# EAGLE design I2CRJ45X8 (EAGLE 9.6.2)

## Sheet 1 of 3
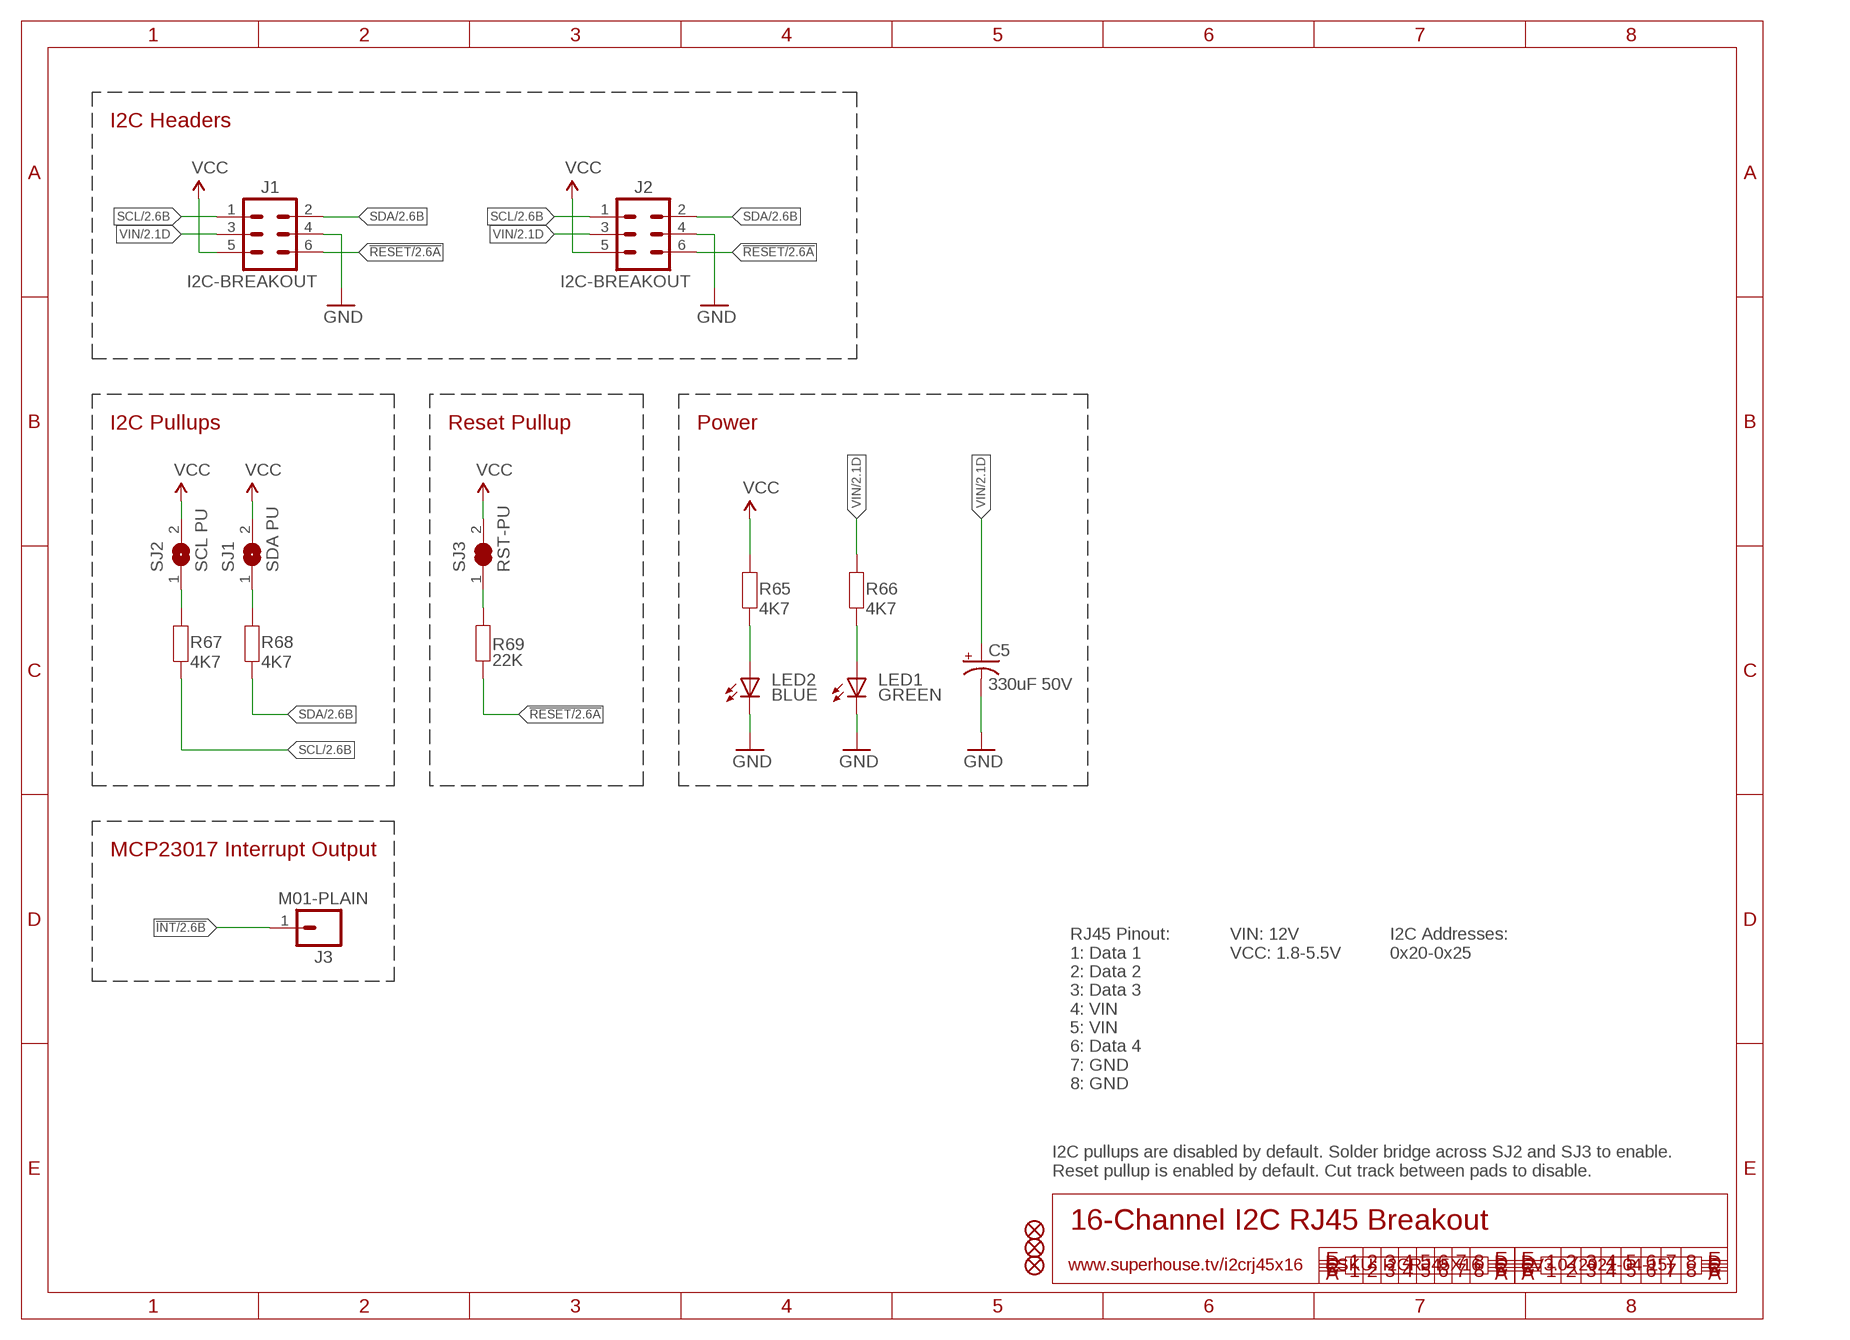
[diagram p0: schematic, sheet 1]

### Parts
C5  330uF 50V  CAP_POLG  [PANASONIC_G]
FID1  FIDUCIAL1X2.5  [FIDUCIAL-1X2.5]
FID2  FIDUCIAL1X2.5  [FIDUCIAL-1X2.5]
FID3  FIDUCIAL1X2.5  [FIDUCIAL-1X2.5]
J1  I2C-BREAKOUT  M02X3-SHROUDED  [2X03-SHROUDED]
J2  I2C-BREAKOUT  M02X3-SHROUDED  [2X03-SHROUDED]
J3  M01-PLAIN  [1X01]
LED1  GREEN  LED0603  [LED-0603]
LED2  BLUE  LED0603  [LED-0603]
R65  4K7  RESISTOR0603  [R0603]
R66  4K7  RESISTOR0603  [R0603]
R67  4K7  RESISTOR0603  [R0603]
R68  4K7  RESISTOR0603  [R0603]
R69  22K  RESISTOR0603  [R0603]
SJ1  SDA PU  SJ-NORMAL  [SJ]
SJ2  SCL PU  SJ-NORMAL  [SJ]
SJ3  RST-PU  SJC-NORMAL  [SJC]

### Nets
!INT: J3.1 ; also sheet 2,3
!RESET: J1.6 J2.6 R69.1 ; also sheet 2,3
GND: C5.- J1.4 J2.4 LED1.C LED2.C ; also sheet 2,3
N$1: R67.2 SJ2.1
N$2: R68.2 SJ1.1
N$3: R69.2 SJ3.1
N$7: LED2.A R65.1
N$8: LED1.A R66.1
SCL: J1.1 J2.1 R67.1 ; also sheet 2,3
SDA: J1.2 J2.2 R68.1 ; also sheet 2,3
VCC: J1.5 J2.5 R65.2 SJ1.2 SJ2.2 SJ3.2 ; also sheet 2,3
VIN: C5.+ J1.3 J2.3 R66.2 ; also sheet 2,3

### Notes on the sheet
- I2C Headers
- I2C Pullups | Reset Pullup | Power
- MCP23017 Interrupt Output
- RJ45 Pinout:
  1: Data 1
  2: Data 2
  3: Data 3
  4: VIN
  5: VIN
  6: Data 4
  7: GND
  8: GND
- VIN: 12V
  VCC: 1.8-5.5V
- I2C Addresses:
  0x20-0x25
- I2C pullups are disabled by default. Solder bridge across SJ2 and SJ3 to enable.
  Reset pullup is enabled by default. Cut track between pads to disable.
- 16-Channel I2C RJ45 Breakout
- www.superhouse.tv/i2crj45x16 | SKU: I2CRJ45X16 | V3.0 (2021-04-15)

## Sheet 2 of 3
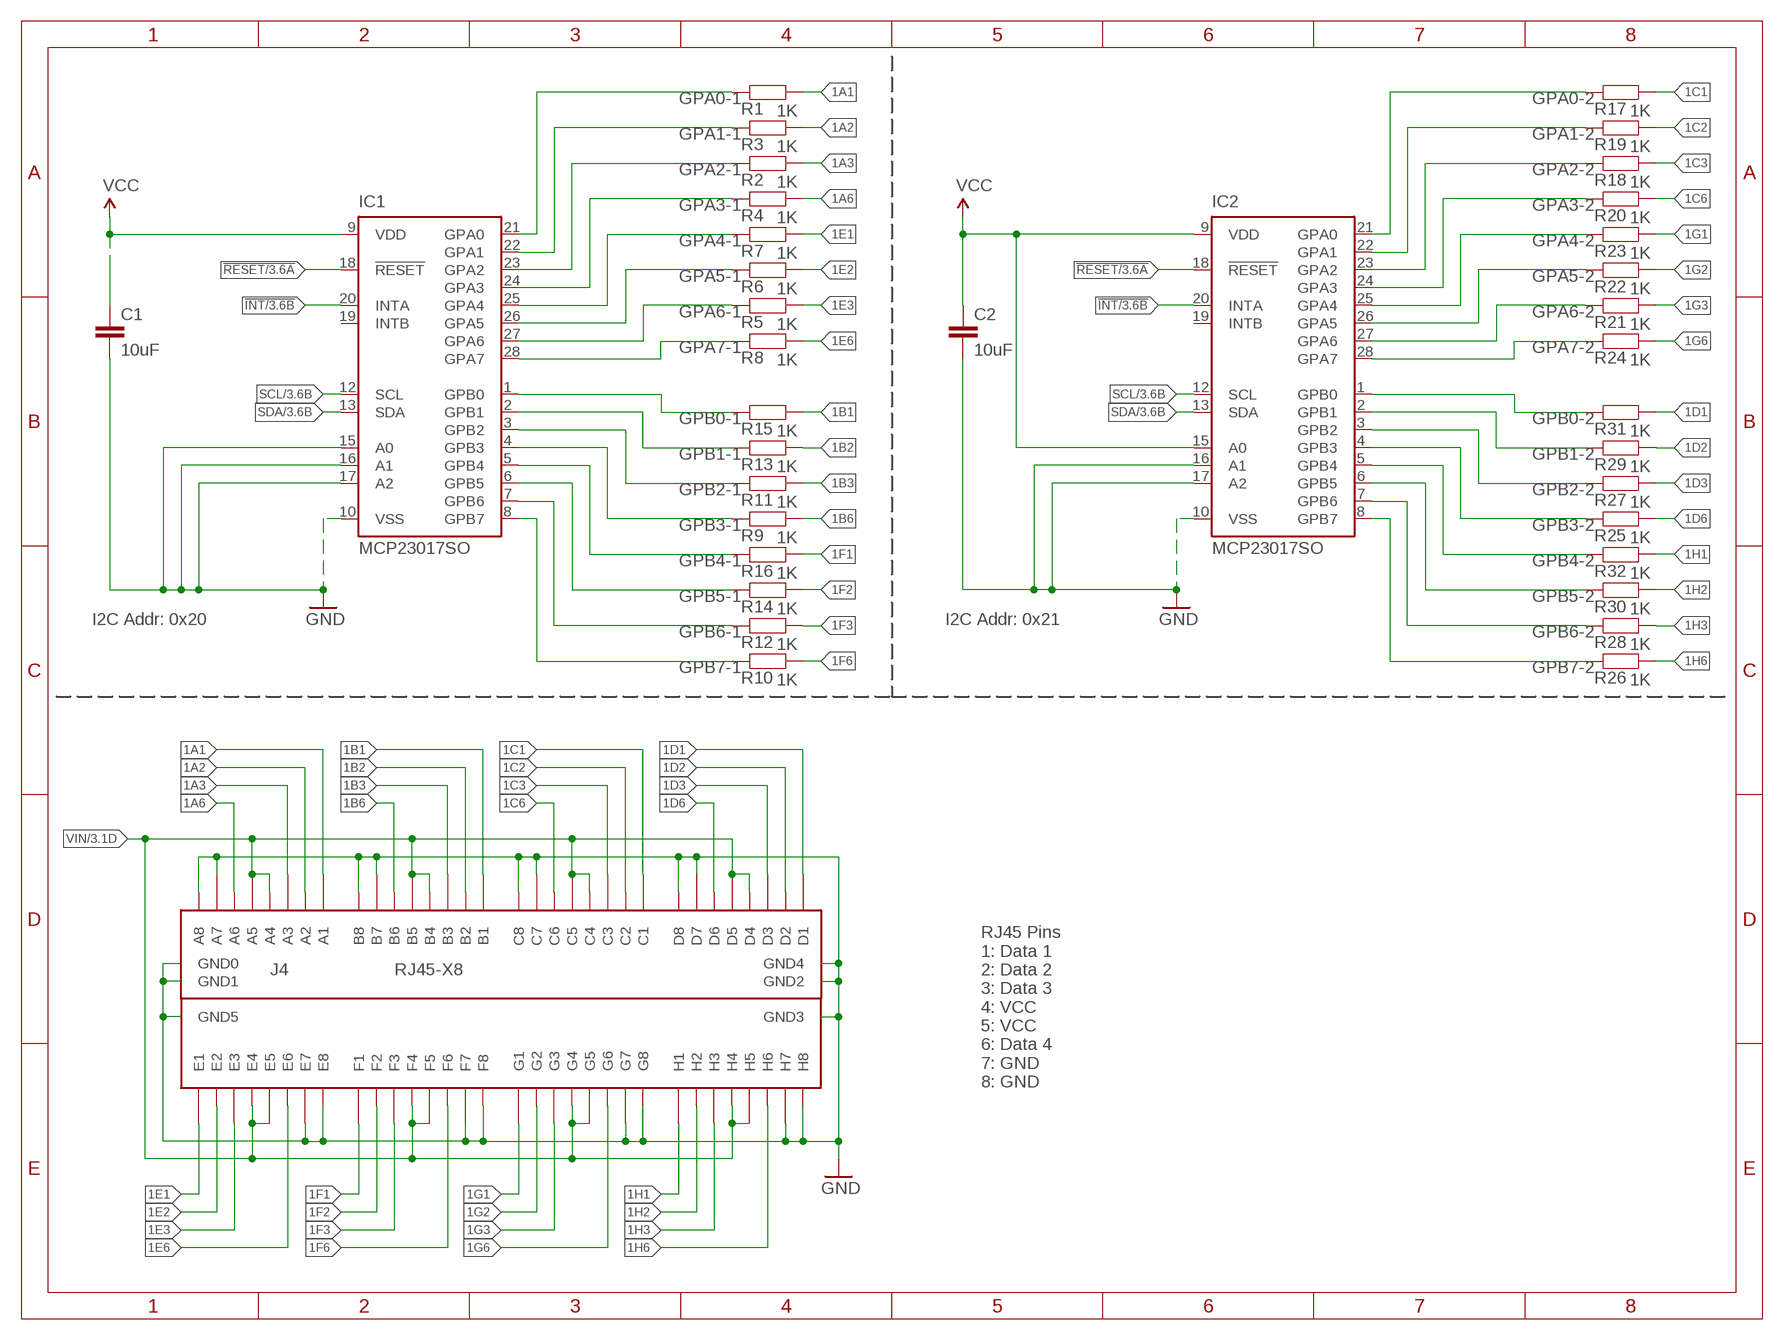
[diagram p1: schematic, sheet 2]

### Parts
C1  10uF  CAP0805  [C0805]
C2  10uF  CAP0805  [C0805]
IC1  MCP23017SO  [SO28W]
IC2  MCP23017SO  [SO28W]
J4  RJ45-X8  [RJ45-2X4]
R1  1K  RESISTOR0603  [R0603]
R2  1K  RESISTOR0603  [R0603]
R3  1K  RESISTOR0603  [R0603]
R4  1K  RESISTOR0603  [R0603]
R5  1K  RESISTOR0603  [R0603]
R6  1K  RESISTOR0603  [R0603]
R7  1K  RESISTOR0603  [R0603]
R8  1K  RESISTOR0603  [R0603]
R9  1K  RESISTOR0603  [R0603]
R10  1K  RESISTOR0603  [R0603]
R11  1K  RESISTOR0603  [R0603]
R12  1K  RESISTOR0603  [R0603]
R13  1K  RESISTOR0603  [R0603]
R14  1K  RESISTOR0603  [R0603]
R15  1K  RESISTOR0603  [R0603]
R16  1K  RESISTOR0603  [R0603]
R17  1K  RESISTOR0603  [R0603]
R18  1K  RESISTOR0603  [R0603]
R19  1K  RESISTOR0603  [R0603]
R20  1K  RESISTOR0603  [R0603]
R21  1K  RESISTOR0603  [R0603]
R22  1K  RESISTOR0603  [R0603]
R23  1K  RESISTOR0603  [R0603]
R24  1K  RESISTOR0603  [R0603]
R25  1K  RESISTOR0603  [R0603]
R26  1K  RESISTOR0603  [R0603]
R27  1K  RESISTOR0603  [R0603]
R28  1K  RESISTOR0603  [R0603]
R29  1K  RESISTOR0603  [R0603]
R30  1K  RESISTOR0603  [R0603]
R31  1K  RESISTOR0603  [R0603]
R32  1K  RESISTOR0603  [R0603]

### Nets
1A1: J4.A1 R1.2
1A2: J4.A2 R3.2
1A3: J4.A3 R2.2
1A6: J4.A6 R4.2
1B1: J4.B1 R15.2
1B2: J4.B2 R13.2
1B3: J4.B3 R11.2
1B6: J4.B6 R9.2
1C1: J4.C1 R17.2
1C2: J4.C2 R19.2
1C3: J4.C3 R18.2
1C6: J4.C6 R20.2
1D1: J4.D1 R31.2
1D2: J4.D2 R29.2
1D3: J4.D3 R27.2
1D6: J4.D6 R25.2
1E1: J4.E1 R7.2
1E2: J4.E2 R6.2
1E3: J4.E3 R5.2
1E6: J4.E6 R8.2
1F1: J4.F1 R16.2
1F2: J4.F2 R14.2
1F3: J4.F3 R12.2
1F6: J4.F6 R10.2
1G1: J4.G1 R23.2
1G2: J4.G2 R22.2
1G3: J4.G3 R21.2
1G6: J4.G6 R24.2
1H1: J4.H1 R32.2
1H2: J4.H2 R30.2
1H3: J4.H3 R28.2
1H6: J4.H6 R26.2
!INT: IC1.20(INTA) IC2.20(INTA) ; also sheet 1,3
!RESET: IC1.18(!RESET) IC2.18(!RESET) ; also sheet 1,3
GND: C1.2 C2.2 IC1.10(VSS) IC1.15(A0) IC1.16(A1) IC1.17(A2) IC2.10(VSS) IC2.16(A1) IC2.17(A2) J4.A7 J4.A8 J4.B7 J4.B8 J4.C7 J4.C8 J4.D7 J4.D8 J4.E7 J4.E8 J4.F7 J4.F8 J4.G7 J4.G8 J4.GND0 J4.GND1 J4.GND2 J4.GND3 J4.GND4 J4.GND5 J4.H7 J4.H8 ; also sheet 1,3
GPA0-1: IC1.21(GPA0) R1.1
GPA0-2: IC2.21(GPA0) R17.1
GPA1-1: IC1.22(GPA1) R3.1
GPA1-2: IC2.22(GPA1) R19.1
GPA2-1: IC1.23(GPA2) R2.1
GPA2-2: IC2.23(GPA2) R18.1
GPA3-1: IC1.24(GPA3) R4.1
GPA3-2: IC2.24(GPA3) R20.1
GPA4-1: IC1.25(GPA4) R7.1
GPA4-2: IC2.25(GPA4) R23.1
GPA5-1: IC1.26(GPA5) R6.1
GPA5-2: IC2.26(GPA5) R22.1
GPA6-1: IC1.27(GPA6) R5.1
GPA6-2: IC2.27(GPA6) R21.1
GPA7-1: IC1.28(GPA7) R8.1
GPA7-2: IC2.28(GPA7) R24.1
GPB0-1: IC1.1(GPB0) R15.1
GPB0-2: IC2.1(GPB0) R31.1
GPB1-1: IC1.2(GPB1) R13.1
GPB1-2: IC2.2(GPB1) R29.1
GPB2-1: IC1.3(GPB2) R11.1
GPB2-2: IC2.3(GPB2) R27.1
GPB3-1: IC1.4(GPB3) R9.1
GPB3-2: IC2.4(GPB3) R25.1
GPB4-1: IC1.5(GPB4) R16.1
GPB4-2: IC2.5(GPB4) R32.1
GPB5-1: IC1.6(GPB5) R14.1
GPB5-2: IC2.6(GPB5) R30.1
GPB6-1: IC1.7(GPB6) R12.1
GPB6-2: IC2.7(GPB6) R28.1
GPB7-1: IC1.8(GPB7) R10.1
GPB7-2: IC2.8(GPB7) R26.1
SCL: IC1.12(SCL) IC2.12(SCL) ; also sheet 1,3
SDA: IC1.13(SDA) IC2.13(SDA) ; also sheet 1,3
VCC: C1.1 C2.1 IC1.9(VDD) IC2.9(VDD) IC2.15(A0) ; also sheet 1,3
VIN: J4.A4 J4.A5 J4.B4 J4.B5 J4.C4 J4.C5 J4.D4 J4.D5 J4.E4 J4.E5 J4.F4 J4.F5 J4.G4 J4.G5 J4.H4 J4.H5 ; also sheet 1,3
Unconnected: IC1.19(INTB) IC2.19(INTB)

### Notes on the sheet
- I2C Addr: 0x20 | I2C Addr: 0x21
- RJ45 Pins
  1: Data 1
  2: Data 2
  3: Data 3
  4: VCC
  5: VCC
  6: Data 4
  7: GND
  8: GND

## Sheet 3 of 3
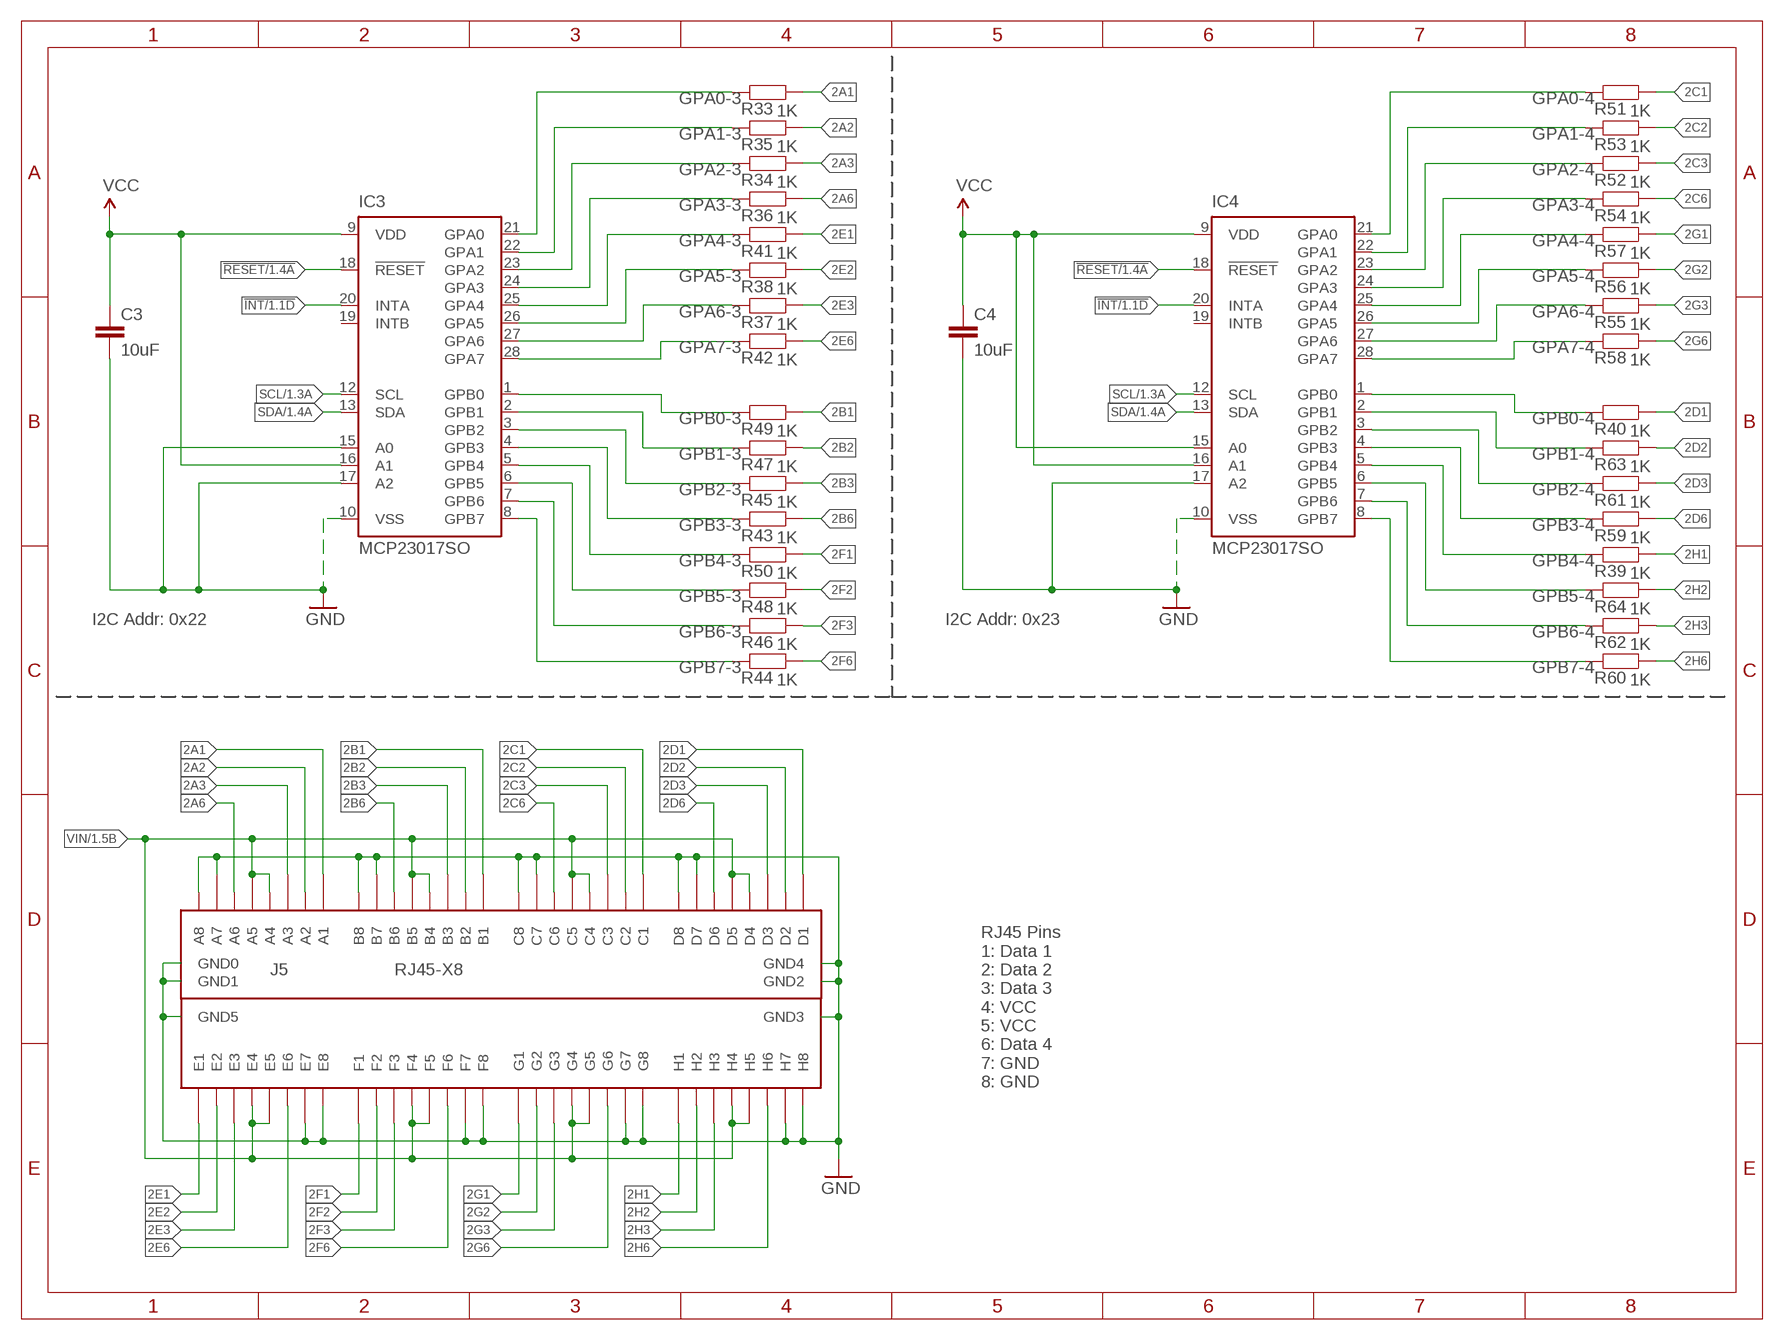
[diagram p2: schematic, sheet 3]

### Parts
C3  10uF  CAP0805  [C0805]
C4  10uF  CAP0805  [C0805]
IC3  MCP23017SO  [SO28W]
IC4  MCP23017SO  [SO28W]
J5  RJ45-X8  [RJ45-2X4]
R33  1K  RESISTOR0603  [R0603]
R34  1K  RESISTOR0603  [R0603]
R35  1K  RESISTOR0603  [R0603]
R36  1K  RESISTOR0603  [R0603]
R37  1K  RESISTOR0603  [R0603]
R38  1K  RESISTOR0603  [R0603]
R39  1K  RESISTOR0603  [R0603]
R40  1K  RESISTOR0603  [R0603]
R41  1K  RESISTOR0603  [R0603]
R42  1K  RESISTOR0603  [R0603]
R43  1K  RESISTOR0603  [R0603]
R44  1K  RESISTOR0603  [R0603]
R45  1K  RESISTOR0603  [R0603]
R46  1K  RESISTOR0603  [R0603]
R47  1K  RESISTOR0603  [R0603]
R48  1K  RESISTOR0603  [R0603]
R49  1K  RESISTOR0603  [R0603]
R50  1K  RESISTOR0603  [R0603]
R51  1K  RESISTOR0603  [R0603]
R52  1K  RESISTOR0603  [R0603]
R53  1K  RESISTOR0603  [R0603]
R54  1K  RESISTOR0603  [R0603]
R55  1K  RESISTOR0603  [R0603]
R56  1K  RESISTOR0603  [R0603]
R57  1K  RESISTOR0603  [R0603]
R58  1K  RESISTOR0603  [R0603]
R59  1K  RESISTOR0603  [R0603]
R60  1K  RESISTOR0603  [R0603]
R61  1K  RESISTOR0603  [R0603]
R62  1K  RESISTOR0603  [R0603]
R63  1K  RESISTOR0603  [R0603]
R64  1K  RESISTOR0603  [R0603]

### Nets
2A1: J5.A1 R33.2
2A2: J5.A2 R35.2
2A3: J5.A3 R34.2
2A6: J5.A6 R36.2
2B1: J5.B1 R49.2
2B2: J5.B2 R47.2
2B3: J5.B3 R45.2
2B6: J5.B6 R43.2
2C1: J5.C1 R51.2
2C2: J5.C2 R53.2
2C3: J5.C3 R52.2
2C6: J5.C6 R54.2
2D1: J5.D1 R40.2
2D2: J5.D2 R63.2
2D3: J5.D3 R61.2
2D6: J5.D6 R59.2
2E1: J5.E1 R41.2
2E2: J5.E2 R38.2
2E3: J5.E3 R37.2
2E6: J5.E6 R42.2
2F1: J5.F1 R50.2
2F2: J5.F2 R48.2
2F3: J5.F3 R46.2
2F6: J5.F6 R44.2
2G1: J5.G1 R57.2
2G2: J5.G2 R56.2
2G3: J5.G3 R55.2
2G6: J5.G6 R58.2
2H1: J5.H1 R39.2
2H2: J5.H2 R64.2
2H3: J5.H3 R62.2
2H6: J5.H6 R60.2
!INT: IC3.20(INTA) IC4.20(INTA) ; also sheet 1,2
!RESET: IC3.18(!RESET) IC4.18(!RESET) ; also sheet 1,2
GND: C3.2 C4.2 IC3.10(VSS) IC3.15(A0) IC3.17(A2) IC4.10(VSS) IC4.17(A2) J5.A7 J5.A8 J5.B7 J5.B8 J5.C7 J5.C8 J5.D7 J5.D8 J5.E7 J5.E8 J5.F7 J5.F8 J5.G7 J5.G8 J5.GND0 J5.GND1 J5.GND2 J5.GND3 J5.GND4 J5.GND5 J5.H7 J5.H8 ; also sheet 1,2
GPA0-3: IC3.21(GPA0) R33.1
GPA0-4: IC4.21(GPA0) R51.1
GPA1-3: IC3.22(GPA1) R35.1
GPA1-4: IC4.22(GPA1) R53.1
GPA2-3: IC3.23(GPA2) R34.1
GPA2-4: IC4.23(GPA2) R52.1
GPA3-3: IC3.24(GPA3) R36.1
GPA3-4: IC4.24(GPA3) R54.1
GPA4-3: IC3.25(GPA4) R41.1
GPA4-4: IC4.25(GPA4) R57.1
GPA5-3: IC3.26(GPA5) R38.1
GPA5-4: IC4.26(GPA5) R56.1
GPA6-3: IC3.27(GPA6) R37.1
GPA6-4: IC4.27(GPA6) R55.1
GPA7-3: IC3.28(GPA7) R42.1
GPA7-4: IC4.28(GPA7) R58.1
GPB0-3: IC3.1(GPB0) R49.1
GPB0-4: IC4.1(GPB0) R40.1
GPB1-3: IC3.2(GPB1) R47.1
GPB1-4: IC4.2(GPB1) R63.1
GPB2-3: IC3.3(GPB2) R45.1
GPB2-4: IC4.3(GPB2) R61.1
GPB3-3: IC3.4(GPB3) R43.1
GPB3-4: IC4.4(GPB3) R59.1
GPB4-3: IC3.5(GPB4) R50.1
GPB4-4: IC4.5(GPB4) R39.1
GPB5-3: IC3.6(GPB5) R48.1
GPB5-4: IC4.6(GPB5) R64.1
GPB6-3: IC3.7(GPB6) R46.1
GPB6-4: IC4.7(GPB6) R62.1
GPB7-3: IC3.8(GPB7) R44.1
GPB7-4: IC4.8(GPB7) R60.1
SCL: IC3.12(SCL) IC4.12(SCL) ; also sheet 1,2
SDA: IC3.13(SDA) IC4.13(SDA) ; also sheet 1,2
VCC: C3.1 C4.1 IC3.9(VDD) IC3.16(A1) IC4.9(VDD) IC4.15(A0) IC4.16(A1) ; also sheet 1,2
VIN: J5.A4 J5.A5 J5.B4 J5.B5 J5.C4 J5.C5 J5.D4 J5.D5 J5.E4 J5.E5 J5.F4 J5.F5 J5.G4 J5.G5 J5.H4 J5.H5 ; also sheet 1,2
Unconnected: IC3.19(INTB) IC4.19(INTB)

### Notes on the sheet
- I2C Addr: 0x22 | I2C Addr: 0x23
- RJ45 Pins
  1: Data 1
  2: Data 2
  3: Data 3
  4: VCC
  5: VCC
  6: Data 4
  7: GND
  8: GND

## Library data of the parts
C1-C4 = SuperHouse-DiscreteSemi:CAP: Capacitor Standard ceramic capacitor
C5 = SuperHouse-DiscreteSemi:CAP_POL: Capacitor Polarized These are standard SMD and PTH capacitors. Normally 10uF, 47uF, and 100uF in electrolytic and tantalum varieties. Always verify the external diameter of the through hole cap, it varies with capacity, voltage, and manufacturer. The EIA devices should be standard.
FID1-FID3 = SuperHouse-Symbols:FIDUCIAL: Fiducial Alignment Points Various fiducial points for machine vision alignment.
IC1-IC4 = SuperHouse-ICs:MCP23017: http://ww1.microchip.com/downloads/en/DeviceDoc/21952a.pdf Source: http://ww1.microchip.com/downloads/en/DeviceDoc/21952a.pdf
J1 J2 = SuperHouse-Connectors:M02X3: 0.1" header, 2x3 (6-way)
J3 = SuperHouse-Connectors:M01: 1-way header Standard 1x1 header
J4 J5 = SuperHouse-Connectors:RJ45-X8: 8-way RJ45 socket, PCB mount. 2 rows of 4.
LED1 LED2 = SuperHouse-LEDs:LED: LEDs Standard schematic elements and footprints for 5mm, 3mm, 1206, and 0603 sized LEDs. 5mm - Spark Fun Electronics SKU : COM-00529 (and others)
R1-R69 = SuperHouse-DiscreteSemi:RESISTOR: Resistors in both surface-mount and through-hole versions.
SJ1 SJ2 = SuperHouse-Jumpers:SJ: SMD solder jumper, normally-open. Add solder to close the connection.
SJ3 = SuperHouse-Jumpers:SJC: Solder jumper. Normally closed: does not need solder to close. Can be opened by cutting the track.

## Board
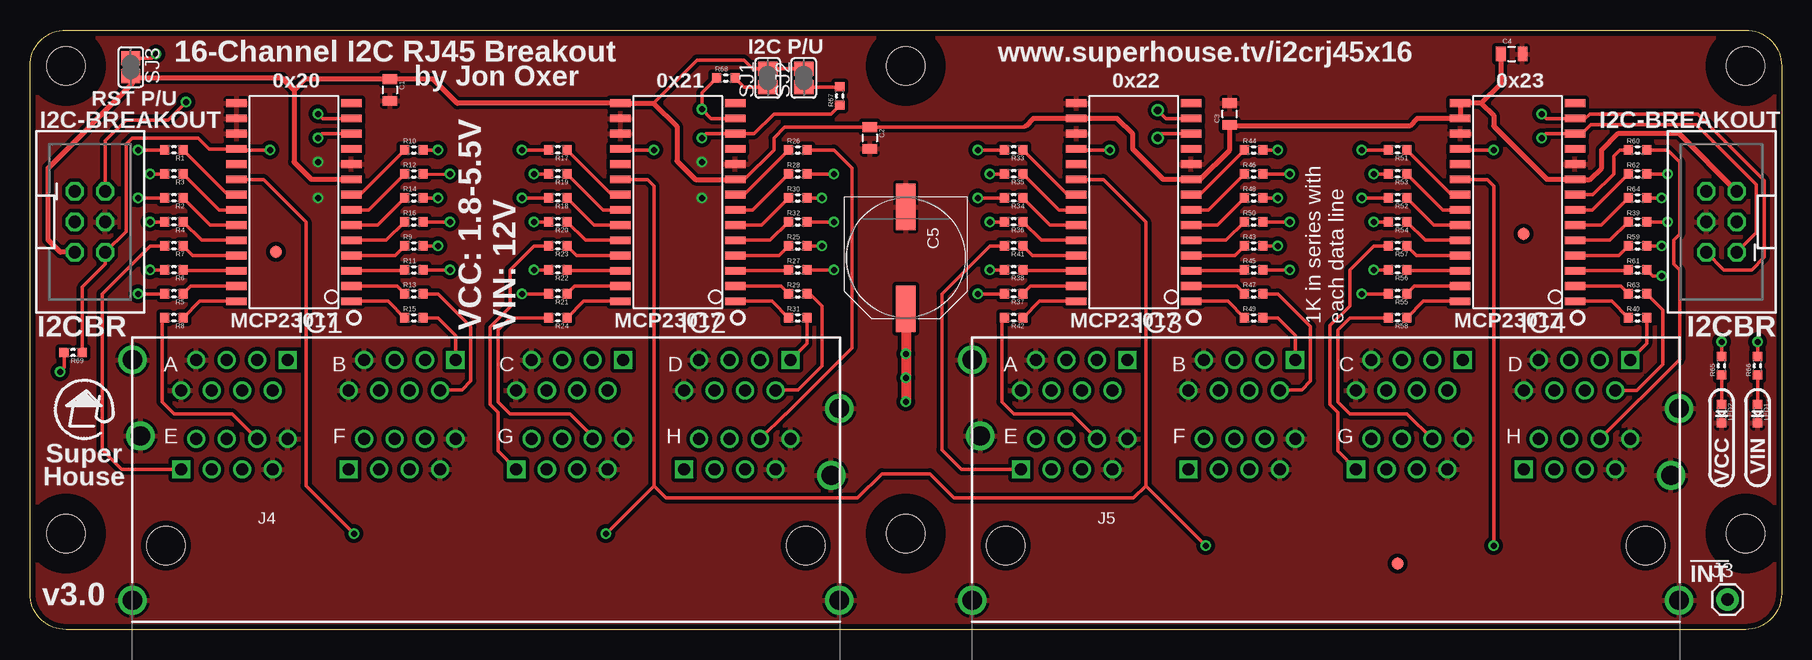
[diagram p3: board, top side]
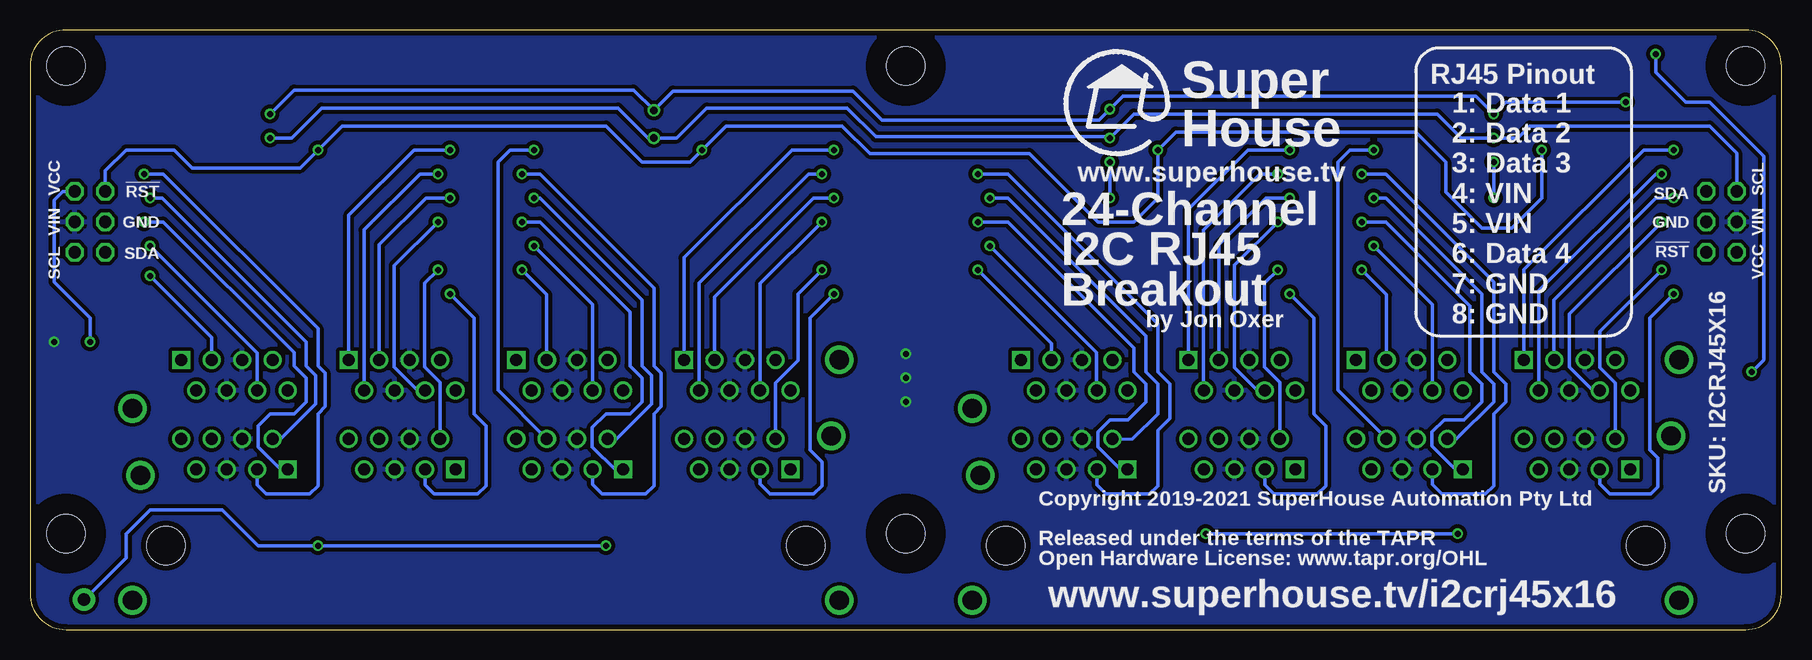
[diagram p4: board, bottom side, seen from below]

Size 146 x 50 mm. Coordinates in mm from the lower left corner, seen from the top.
Outline: 3,0 arc-90 0,3 0,47 arc-90 3,50 143,50 arc-90 146,47 146,3 arc-90 143,0 3,0
Copper layers (1*16): Top 0.035mm / dielectric 1.5mm / Bottom 0.035mm
Design rules "default *": minimum track width 10mil, minimum drill 0.5mm, track to track 12mil, track to pad 12mil, pad to pad 12mil, via to via 12mil, smd to smd 8mil, copper to edge 18mil, drill to drill 8mil, minimum pad ring 10mil, minimum via ring 8mil, stop-mask expansion 4mil, vias tented up to drill 25mil, thermal gap 10mil
Holes 3.2 mm at 143,8 143,47 73,8 73,47 3,8 3,47
tRestrict: area 69.8,4.8 to 76.2,11.2; area 139.8,4.8 to 146.2,11.2; area 139.8,43.8 to 146.2,50.2; area 69.8,43.8 to 76.2,50.2; area -0.2,4.8 to 6.2,11.2; area -0.2,43.8 to 6.2,50.2
bRestrict: area 69.8,43.8 to 76.2,50.2; area 139.8,43.8 to 146.2,50.2; area 69.8,4.8 to 76.2,11.2; area 139.8,4.8 to 146.2,11.2; area -0.2,4.8 to 6.2,11.2; area -0.2,43.8 to 6.2,50.2

### Footprints (pad centres in the part's own frame; a part is rotated, then mirrored left to right if it is on the bottom)
C0805 = smd 0.8 x 1.2: 1 -0.9,0; 2 0.9,0
PANASONIC_G = smd 3.9 x 1.6: + 4.25,0; - -4.25,0
FIDUCIAL-1X2.5 = smd 1 x 1: 1 0,0
SO28W = smd 0.65 x 1.7: 1 -7.62,-4.78; 2 -6.35,-4.78; 3 -5.08,-4.78; 4 -3.81,-4.78; 5 -2.54,-4.78; 6 -1.27,-4.78; 7 0,-4.78; 8 1.27,-4.78; 9 2.54,-4.78; 10 3.81,-4.78; 11 5.08,-4.78; 12 6.35,-4.78; 13 7.62,-4.78; 14 8.89,-4.78; 15 8.89,4.78; 16 7.62,4.78; 17 6.35,4.78; 18 5.08,4.78; 19 3.81,4.78; 20 2.54,4.78; 21 1.27,4.78; 22 0,4.78; 23 -1.27,4.78; 24 -2.54,4.78; 25 -3.81,4.78; 26 -5.08,4.78; 27 -6.35,4.78; 28 -7.62,4.78
2X03-SHROUDED = drill 1.016 octagon: 1 -1.27,2.54; 2 1.27,2.54; 3 -1.27,0; 4 1.27,0; 5 -1.27,-2.54; 6 1.27,-2.54
1X01 = drill 1.016 pad 1.88: 1 0,0
RJ45-2X4 = drill 1 square: A1 -16.51,15.49; B1 -2.54,15.49; C1 11.43,15.49; D1 25.4,15.49; E1 -25.4,6.35; F1 -11.43,6.35; G1 2.54,6.35; H1 16.51,6.35 | drill 1: A2 -17.78,12.95; A3 -19.05,15.49; A4 -20.32,12.95; A5 -21.59,15.49; A6 -22.86,12.95; A7 -24.13,15.49; A8 -25.4,12.95; B2 -3.81,12.95; B3 -5.08,15.49; B4 -6.35,12.95; B5 -7.62,15.49; B6 -8.89,12.95; B7 -10.16,15.49; B8 -11.43,12.95; C2 10.16,12.95; C3 8.89,15.49; C4 7.62,12.95; C5 6.35,15.49; C6 5.08,12.95; C7 3.81,15.49; C8 2.54,12.95; D2 24.13,12.95; D3 22.86,15.49; D4 21.59,12.95; D5 20.32,15.49; D6 19.05,12.95; D7 17.78,15.49; D8 16.51,12.95; E2 -24.13,8.89; E3 -22.86,6.35; E4 -21.59,8.89; E5 -20.32,6.35; E6 -19.05,8.89; E7 -17.78,6.35; E8 -16.51,8.89; F2 -10.16,8.89; F3 -8.89,6.35; F4 -7.62,8.89; F5 -6.35,6.35; F6 -5.08,8.89; F7 -3.81,6.35; F8 -2.54,8.89; G2 3.81,8.89; G3 5.08,6.35; G4 6.35,8.89; G5 7.62,6.35; G6 8.89,8.89; G7 10.16,6.35; G8 11.43,8.89; H2 17.78,8.89; H3 19.05,6.35; H4 20.32,8.89; H5 21.59,6.35; H6 22.86,8.89; H7 24.13,6.35; H8 25.4,8.89 | drill 1.6: GND0 29.464,-4.572; GND1 28.79,5.85; GND2 -29.46,15.5; GND3 -28.79,9.15; GND4 -29.464,-4.572; GND5 29.46,11.43 | hole 3.2: 26.67,0; -26.67,0
LED-0603 = smd 0.762 x 0.762: A -0.762,0; C 0.762,0
R0603 = smd 0.762 x 0.762: 1 -0.762,0; 2 0.762,0
SJ = smd 1.168 x 1.6: 1 -0.762,0; 2 0.762,0
SJC = smd 1.168 x 1.6: 1 -0.762,0; 2 0.762,0

### Placement (x,y rotation side)
C1  30,45 270 top
C2  70,41 270 top
C3  100,43 90 top
C4  123.5,48 0 top
C5  73,31 270 top
FID1  20.5,31.5 0 top
FID2  124.5,33 0 top
FID3  114,5.5 0 top
IC1  22,35 90 top
IC2  54,35 90 top
IC3  92,35 90 top
IC4  124,35 90 top
J1  5,34 0 top
J2  141,34 180 top
J3  141.5,2.5 0 top
J4  38,7 0 top
J5  108,7 0 top
LED1  144,18 270 top
LED2  141,18 270 top
R1  12,40 180 top
R2  12,36 180 top
R3  12,38 180 top
R4  12,34 180 top
R5  12,28 180 top
R6  12,30 180 top
R7  12,32 180 top
R8  12,26 180 top
R9  32,32 0 top
R10  32,40 0 top
R11  32,30 0 top
R12  32,38 0 top
R13  32,28 0 top
R14  32,36 0 top
R15  32,26 0 top
R16  32,34 0 top
R17  44,40 180 top
R18  44,36 180 top
R19  44,38 180 top
R20  44,34 180 top
R21  44,28 180 top
R22  44,30 180 top
R23  44,32 180 top
R24  44,26 180 top
R25  64,32 0 top
R26  64,40 0 top
R27  64,30 0 top
R28  64,38 0 top
R29  64,28 0 top
R30  64,36 0 top
R31  64,26 0 top
R32  64,34 0 top
R33  82,40 180 top
R34  82,36 180 top
R35  82,38 180 top
R36  82,34 180 top
R37  82,28 180 top
R38  82,30 180 top
R39  134,34 0 top
R40  134,26 0 top
R41  82,32 180 top
R42  82,26 180 top
R43  102,32 0 top
R44  102,40 0 top
R45  102,30 0 top
R46  102,38 0 top
R47  102,28 0 top
R48  102,36 0 top
R49  102,26 0 top
R50  102,34 0 top
R51  114,40 180 top
R52  114,36 180 top
R53  114,38 180 top
R54  114,34 180 top
R55  114,28 180 top
R56  114,30 180 top
R57  114,32 180 top
R58  114,26 180 top
R59  134,32 0 top
R60  134,40 0 top
R61  134,30 0 top
R62  134,38 0 top
R63  134,28 0 top
R64  134,36 0 top
R65  141,22 90 top
R66  144,22 90 top
R67  67.5,44.5 90 top
R68  58,46 0 top
R69  3.6,23.1 180 top
SJ1  61.5,46 90 top
SJ2  64.5,46 90 top
SJ3  8.4,46.9 270 top

### Tracks (layer width: path | path; a pad name or v marks a point on that pad's centre or on a via)
1A1  (via drill 0.5)
  Top 0.305: v9,40 R1.2
  Bottom 0.305: J4.A1 21.49,30.01 11.5,40 v9,40
1A2  (via drill 0.5)
  Top 0.305: v10,38 R3.2
  Bottom 0.305: J4.A2 20.22,28.28 10.5,38 v10,38
1A3  (via drill 0.5)
  Top 0.305: v9,36 R2.2
  Bottom 0.254: J4.A3 19,22.54
  Bottom 0.305: 19,22.54 19,27.5 10.5,36 v9,36
1A6  (via drill 0.5)
  Top 0.305: v10,34 R4.2
  Bottom 0.305: v10,34 17.7,26.3 17.7,21.9 15.75,19.95 J4.A6
1B1
  Top 0.305: R15.2 34,26 35.46,24.54 J4.B1
1B2
  Top 0.254: J4.B2 34.24,20
  Top 0.305: 34.24,20 36,20 36.75,20.75 36.75,25.25 34,28 R13.2
1B3  (via drill 0.5)
  Top 0.305: R11.2 v35,30
  Bottom 0.305: J4.B3 32.92,27.92 v35,30
1B6  (via drill 0.5)
  Top 0.305: R9.2 v34,32
  Bottom 0.305: J4.B6 29.11,27.11 v34,32
1C1  (via drill 0.5)
  Top 0.305: v41,40 R17.2
  Bottom 0.305: J4.C1 49.43,35.07 44.5,40 v41,40
1C2  (via drill 0.5)
  Top 0.305: v42,38 R19.2
  Bottom 0.254: J4.C2 48.18,19.97
  Bottom 0.305: 48.18,19.97 48.18,33.32 43.5,38 v42,38
1C3  (via drill 0.5)
  Top 0.305: v41,36 R18.2
  Bottom 0.254: J4.C3
  Bottom 0.305: J4.C3 46.9,32.1 43,36 v41,36
1C6  (via drill 0.5)
  Top 0.305: v42,34 R20.2
  Bottom 0.305: v42,34 45.6,30.4 45.6,21.87 43.69,19.95 J4.C6
1D1
  Top 0.305: J4.D1 64.76,23.85 R31.2
1D2
  Top 0.254: J4.D2 62.18,20 | 65,28 R29.2
  Top 0.305: 62.18,20 64,20 66,22 66,27 65,28
1D3  (via drill 0.5)
  Top 0.305: R27.2 v67,30
  Bottom 0.305: J4.D3 60.86,23.86 v67,30
1D6  (via drill 0.5)
  Top 0.305: R25.2 v66,32
  Bottom 0.254: J4.D6 57.1,20
  Bottom 0.305: 57.1,20 57.1,23.1 v66,32
1E1
  Top 0.305: J4.E1 7.65,13.35 6,15 6,28 10,32 R7.2
1E2  (via drill 0.5)
  Top 0.305: v10,30 R6.2
  Bottom 0.305: v10,30 15.16,24.84 15.16,21.86 13.87,20.57 J4.E2
1E3  (via drill 0.5)
  Top 0.305: v9,28 R5.2
  Bottom 0.305: J4.E3 15.14,12.14 14.3,11.3 10.9,11.3 10.3,11.9 10.3,14.3 11,15 11,26 v9,28
1E6
  Top 0.254: 11,25.76 R8.2
  Top 0.305: J4.E6 16.84,18 12,18 11,19 11,25.76
1F1  (via drill 0.5)
  Top 0.305: R16.2 v35,34
  Bottom 0.305: v35,34 33,34 26,27 26,21.5 25,20.5 25,19 26.5,17.5 28.1,17.5 29.13,16.47 29.13,15.3 27.18,13.35 J4.F1
1F2  (via drill 0.5)
  Top 0.305: R14.2 v34,36
  Bottom 0.305: J4.F2 27.11,15.89 24,19 24,20.5 25,21.5 25,28 33,36 v34,36
1F3  (via drill 0.5)
  Top 0.254: R12.2 v35,38
  Bottom 0.305: J4.F3 29.11,12.11 28.3,11.3 24.7,11.3 24,12 24,18 23,19 23,20.5 24,21.5 24,29 33,38 v35,38
1F6  (via drill 0.5)
  Top 0.305: v34,40 R10.2
  Bottom 0.254: J4.F6 32.92,15.92
  Bottom 0.305: 32.92,15.92 37,20 37,39 36,40 v34,40
1G1
  Top 0.305: R23.2 42,32 40,30 40,26.89 38.34,25.23 38.34,18.77 39,18.11 39,14.89 J4.G1
1G2  (via drill 0.5)
  Top 0.305: v42,30 R22.2
  Bottom 0.305: J4.G2 41.81,20.61 43.1,21.9 43.1,28.9 v42,30
1G3  (via drill 0.5)
  Top 0.305: v41,28 R21.2
  Bottom 0.305: J4.G3 43.08,12.08 42.3,11.3 38.7,11.3 38,12 38,17 39,18 39,26 v41,28
1G6
  Top 0.254: J4.G6 46.89,16.11
  Top 0.305: 46.89,16.11 45,18 40,18 39,19 39,25 40,26 R24.2
1H1  (via drill 0.5)
  Top 0.305: R32.2 v67,34
  Bottom 0.305: v67,34 64.5,34 54,23.5 54,21.5 53,20.5 53,19 54.5,17.5 56,17.5 57,16.5 57,15.23 55.12,13.35 J4.H1
1H2  (via drill 0.5)
  Top 0.305: R30.2 v66,36
  Bottom 0.254: J4.H2 54.11,15.89
  Bottom 0.305: 54.11,15.89 52,18 52,20.5 53,21.5 53,24.5 64.5,36 v66,36
1H3  (via drill 0.5)
  Top 0.305: R28.2 v67,38
  Bottom 0.305: J4.H3 57.05,12.05 56.3,11.3 52.7,11.3 52,12 52,16.6 51,17.6 51,20.5 52,21.5 52,25.5 64.5,38 v67,38
1H6
  Top 0.305: J4.H6 62.97,18 63,18 68.5,23.5 68.5,38.5 67,40 R26.2
2A1  (via drill 0.5)
  Top 0.305: R33.2 v79,40
  Bottom 0.305: v79,40 82.5,40 91.49,31.01 J5.A1
2A2  (via drill 0.5)
  Top 0.305: R35.2 v80,38
  Bottom 0.305: J5.A2 90.22,28.88 81.1,38 v80,38
2A3  (via drill 0.5)
  Top 0.305: R34.2 v79,36
  Bottom 0.305: v79,36 80.7,36 88.95,27.75 J5.A3
2A6  (via drill 0.5)
  Top 0.305: R36.2 v80,34
  Bottom 0.305: v80,34 85.14,28.86 J5.A6
2B1
  Top 0.305: R49.2 104,26 105.46,24.54 J5.B1
2B2
  Top 0.254: J5.B2 104.24,20
  Top 0.305: 104.24,20 106,20 106.75,20.75 106.75,25.25 104,28 R47.2
2B3  (via drill 0.5)
  Top 0.305: R45.2 v105,30
  Bottom 0.305: v105,30 102.92,27.92 J5.B3
2B6  (via drill 0.5)
  Top 0.305: R43.2 v104,32
  Bottom 0.305: v104,32 99.11,27.11 J5.B6
2C1  (via drill 0.5)
  Top 0.305: R51.2 v111,40
  Bottom 0.305: J5.C1 119.43,34.57 114,40 v111,40
2C2  (via drill 0.5)
  Top 0.305: R53.2 v112,38
  Bottom 0.305: v112,38 113.5,38 118.16,33.34 J5.C2
2C3  (via drill 0.5)
  Top 0.305: R52.2 v111,36
  Bottom 0.305: v111,36 113,36 116.89,32.11 J5.C3
2C6  (via drill 0.5)
  Top 0.305: R54.2 v112,34
  Bottom 0.305: J5.C6 113.69,19.95 115.64,21.9 115.64,30.36 v112,34
2D1
  Top 0.305: R40.2 134.76,23.85 J5.D1
2D2
  Top 0.305: J5.D2 133.95,19.95 136.1,22.1 136.1,26.66 R63.2
2D3  (via drill 0.5)
  Top 0.305: R61.2 135.26,29.5 v136,29.5
  Bottom 0.305: v136,29.5 130.86,24.36 J5.D3
2D6  (via drill 0.5)
  Top 0.305: R59.2 v136,32
  Bottom 0.305: v136,32 127.05,23.05 J5.D6
2E1
  Top 0.305: R41.2 80,32 76,28 76,15 77.65,13.35 J5.E1
2E2  (via drill 0.5)
  Top 0.305: R38.2 v80,30
  Bottom 0.254: J5.E2 83.85,15.91
  Bottom 0.305: v80,30 82,28 82,22.43 83.85,20.57 83.85,15.91
2E3  (via drill 0.5)
  Top 0.305: R37.2 v79,28
  Bottom 0.305: v79,28 81,26 81,15 80,14 80,12 80.7,11.3 84.3,11.3 85.14,12.14 J5.E3
2E6
  Top 0.254: R42.2 81,25.76
  Top 0.305: J5.E6 86.84,18 82,18 81,19 81,25.76
2F1  (via drill 0.5)
  Top 0.305: R50.2 v105,34
  Bottom 0.305: J5.F1 97.25,13.35 99.13,15.23 99.13,16.87 98,18 96,18 95,19 95,21 96,22 96,26.5 103.5,34 v105,34
2F2  (via drill 0.5)
  Top 0.305: R48.2 v104,36
  Bottom 0.305: v104,36 103.5,36 95,27.5 95,22 94.2,21.2 94.2,18.8 97.11,15.89 J5.F2
2F3  (via drill 0.5)
  Top 0.305: R46.2 v105,38
  Bottom 0.305: v105,38 103.5,38 94,28.5 94,22 93.4,21.4 93.4,18.6 94,18 94,12 94.7,11.3 98.3,11.3 99.11,12.11 J5.F3
2F6  (via drill 0.5)
  Top 0.305: v104,40 R44.2
  Bottom 0.305: v104,40 106,40 107,39 107,19.97 J5.F6
2G1
  Top 0.305: J5.G1 109,14.89 109,18.11 108.34,18.77 108.34,25.34 110,27 110,30 112,32 R57.2
2G2  (via drill 0.5)
  Top 0.305: R56.2 v112,30
  Bottom 0.305: v112,30 113.1,28.9 113.1,21.9 111.81,20.61 J5.G2
2G3  (via drill 0.5)
  Top 0.305: R55.2 v111,28
  Bottom 0.305: J5.G3 113.08,12.08 112.3,11.3 108.7,11.3 108,12 108,17 109,18 109,26 v111,28
2G6
  Top 0.305: R58.2 110,26 109,25 109,19 110,18 114.78,18 J5.G6
2H1  (via drill 0.5)
  Top 0.305: R39.2 v136.5,34
  Bottom 0.305: v136.5,34 134.9,34 124,23.1 124,22 123,21 123,19 124,18 126,18 127,17 127,15.23 125.12,13.35 J5.H1
2H2  (via drill 0.5)
  Top 0.305: R64.2 v136,36
  Bottom 0.254: 125.11,15.89 J5.H2
  Bottom 0.305: v136,36 135,36 123,24 123,22 122.2,21.2 122.2,18.8 125.11,15.89
2H3  (via drill 0.5)
  Top 0.305: R62.2 v136.5,38
  Bottom 0.305: v136.5,38 134.9,38 122,25.1 122,22 121.4,21.4 121.4,18.6 122,18 122,12 122.7,11.3 126.3,11.3 127.05,12.05 J5.H3
2H6
  Top 0.305: R60.2 136.5,40 137.5,39 137.5,33 137,32.5 137,30.5 137.5,30 137.5,22.53 J5.H6
!INT  (via drill 0.5)
  Top 0.305: IC1.20 19.46,37.54 23,34 23,12 v27,8 | IC2.20 51.46,37.54 52,37 52,12 | 52,12 53.01,10.99 68.99,10.99 71,13 75,13 77,11 91.99,10.99 93,12 | IC4.20 121.46,37.54 122,37 v122,7 | IC3.20 89.46,37.54 93,34 93,12 | 93,12 v98,7 | v48,8 52,12
  Bottom 0.305: v98,7 v122,7 127,7 130,10 136,10 138,8 138,6 J3.1 | v48,8 v27,8
!RESET  (via drill 0.5)
  Top 0.254: 119.3,40 IC4.18 | 87.3,40 IC3.18 | 17.3,40 IC1.18
  Top 0.305: v122,40 119.3,40 | v90,40 87.3,40 | v52,40 49.3,40 IC2.18 | v20,40 17.3,40 | IC1.18 14.92,40.08 14,41 8.5,41 8,40.5 8,33.19 J1.6 6.27,30.46 4.36,28.55 R69.1
  Bottom 0.305: v20,40 20,36 22.5,33.5 25,33.5 28,36.5 28,39 30.5,41.5 50.5,41.5 v52,40 52,36 54,34 57,34 62.7,39.7 76,39.7 78.3,42 88,42 v90,40 91,39 95,39 98,42 120,42 v122,40 123.5,38.5 132.5,38.5 134,40 138,40 139.73,38.27 J2.6
GND  (via drill 0.5)
  Bottom 0.305: v24,39 v24,36 | v56,39 v56,36
  pour Top: 143,0 arc90 146,3 146,47 arc90 143,50 3,50 arc90 0,47 0,3 arc90 3,0
GPA0-1
  Top 0.305: IC1.21 16.49,36.27 R1.1
GPA0-2
  Top 0.305: IC2.21 48.49,36.27 R17.1
GPA0-3
  Top 0.305: IC3.21 86.49,36.27 R33.1
GPA0-4
  Top 0.305: IC4.21 118.49,36.27 R51.1
GPA1-1
  Top 0.305: IC1.22 15.76,35 R3.1
GPA1-2
  Top 0.305: IC2.22 47.76,35 R19.1
GPA1-3
  Top 0.305: IC3.22 85.76,35 R35.1
GPA1-4
  Top 0.305: IC4.22 117.76,35 R53.1
GPA2-1
  Top 0.305: IC1.23 15.03,33.73 R2.1
GPA2-2
  Top 0.305: IC2.23 47.03,33.73 R18.1
GPA2-3
  Top 0.305: IC3.23 85.03,33.73 R34.1
GPA2-4
  Top 0.305: IC4.23 117.03,33.73 R52.1
GPA3-1
  Top 0.305: R4.1 14.3,32.46 IC1.24
GPA3-2
  Top 0.305: R20.1 46.3,32.46 IC2.24
GPA3-3
  Top 0.305: IC3.24 84.3,32.46 R36.1
GPA3-4
  Top 0.305: IC4.24 116.3,32.46 R54.1
GPA4-1
  Top 0.305: R7.1 13.57,31.19 IC1.25
GPA4-2
  Top 0.305: R23.1 45.57,31.19 IC2.25
GPA4-3
  Top 0.305: IC3.25 83.57,31.19 R41.1
GPA4-4
  Top 0.305: IC4.25 115.57,31.19 R57.1
GPA5-1
  Top 0.254: R6.1 12.84,29.92
  Top 0.305: IC1.26 12.84,29.92
GPA5-2
  Top 0.254: R22.1 44.84,29.92
  Top 0.305: IC2.26 44.84,29.92
GPA5-3
  Top 0.254: 82.84,29.92 R38.1
  Top 0.305: IC3.26 82.84,29.92
GPA5-4
  Top 0.254: 114.84,29.92 R56.1
  Top 0.305: IC4.26 114.84,29.92
GPA6-1
  Top 0.305: IC1.27 13.41,28.65 R5.1
GPA6-2
  Top 0.305: IC2.27 45.41,28.65 R21.1
GPA6-3
  Top 0.305: IC3.27 83.41,28.65 R37.1
GPA6-4
  Top 0.305: IC4.27 115.41,28.65 R55.1
GPA7-1
  Top 0.305: IC1.28 14.14,27.38 R8.1
GPA7-2
  Top 0.305: IC2.28 46.14,27.38 R24.1
GPA7-3
  Top 0.305: IC3.28 84.14,27.38 R42.1
GPA7-4
  Top 0.305: IC4.28 116.14,27.38 R58.1
GPB0-1
  Top 0.305: IC1.1 29.86,27.38 R15.1
GPB0-2
  Top 0.305: IC2.1 61.86,27.38 R31.1
GPB0-3
  Top 0.305: IC3.1 99.86,27.38 R49.1
GPB0-4
  Top 0.305: IC4.1 131.86,27.38 R40.1
GPB1-1
  Top 0.305: IC1.2 30.59,28.65 R13.1
GPB1-2
  Top 0.305: IC2.2 62.59,28.65 R29.1
GPB1-3
  Top 0.305: IC3.2 100.59,28.65 R47.1
GPB1-4
  Top 0.305: IC4.2 132.59,28.65 R63.1
GPB2-1
  Top 0.254: R11.1 31.16,29.92
  Top 0.305: 31.16,29.92 IC1.3
GPB2-2
  Top 0.254: R27.1 63.16,29.92
  Top 0.305: 63.16,29.92 IC2.3
GPB2-3
  Top 0.305: IC3.3 101.16,29.92 R45.1
GPB2-4
  Top 0.254: 133.16,29.92 R61.1
  Top 0.305: IC4.3 133.16,29.92
GPB3-1
  Top 0.305: R9.1 30.43,31.19 IC1.4
GPB3-2
  Top 0.305: R25.1 62.43,31.19 IC2.4
GPB3-3
  Top 0.305: IC3.4 100.43,31.19 R43.1
GPB3-4
  Top 0.305: IC4.4 132.43,31.19 R59.1
GPB4-1
  Top 0.305: R16.1 29.7,32.46 IC1.5
GPB4-2
  Top 0.305: R32.1 61.7,32.46 IC2.5
GPB4-3
  Top 0.305: IC3.5 99.7,32.46 R50.1
GPB4-4
  Top 0.305: IC4.5 131.7,32.46 R39.1
GPB5-1
  Top 0.305: IC1.6 28.97,33.73 R14.1
GPB5-2
  Top 0.305: IC2.6 60.97,33.73 R30.1
GPB5-3
  Top 0.305: IC3.6 98.97,33.73 R48.1
GPB5-4
  Top 0.305: IC4.6 130.97,33.73 R64.1
GPB6-1
  Top 0.305: IC1.7 28.24,35 R12.1
GPB6-2
  Top 0.305: IC2.7 60.24,35 R28.1
GPB6-3
  Top 0.305: IC3.7 98.24,35 R46.1
GPB6-4
  Top 0.305: IC4.7 130.24,35 R62.1
GPB7-1
  Top 0.254: IC1.8 27.51,36.27
  Top 0.305: 27.51,36.27 R10.1
GPB7-2
  Top 0.254: IC2.8 59.51,36.27
  Top 0.305: 59.51,36.27 R26.1
GPB7-3
  Top 0.254: IC3.8 97.51,36.27
  Top 0.305: 97.51,36.27 R44.1
GPB7-4
  Top 0.305: IC4.8 130.27,36.27 132,38 132,39.5 132.5,40 R60.1
N$1
  Top 0.305: SJ2.1 67.48,45.24 R67.2
N$2
  Top 0.305: SJ1.1 59.52,45.24 R68.2
N$3  (via drill 0.5)
  Top 0.305: R69.2 2.84,21.84 v2.5,21.5 | v10.5,48 10.16,47.66 SJ3.1
  Bottom 0.305: v2.5,21.5 1.5,22.5 1.5,39.5 6,44 8,44 10.5,46.5 v10.5,48
N$7
  Top 0.305: LED2.A R65.1
N$8
  Top 0.305: R66.1 LED1.A
SCL  (via drill 0.5, 0.61)
  Top 0.254: IC4.12 129.35,41.35
  Top 0.305: 129.35,41.35 130.1,42.1 138.9,42.1 143.9,37.1 143.9,33.09 J2.1 | IC4.12 126.35,41.35 v126,41 | v94,41 94.35,41.35 IC3.12 | v56,41 56.35,41.35 IC2.12 60.35,41.35 62,43 66.76,43 R67.1 | IC1.12 24.35,41.35 v24,41
  Bottom 0.305: v126,41 124.2,41 121.7,43.5 97,43.5 94.5,41 v94,41 92.1,41 89.6,43.5 77.9,43.5 75.5,41.1 56.1,41.1 v56,41 54,43 28.7,43 26.7,41 v24,41 22,41 21,42 6,42 3.73,39.73 J1.1
SDA  (via drill 0.5, 0.61)
  Top 0.254: 129.62,42.62 IC4.13
  Top 0.305: IC4.13 126.38,42.62 v126,43 | v94,43.3 94.68,42.62 IC3.13 | IC2.13 56.78,42.62 v56,43.4 56,44.76 R68.1 | IC1.13 24.38,42.62 v24,43 | J2.2 141.19,30 143.5,30 144.56,31.06 144.56,37.44 139,43 130,43 129.62,42.62 | v13,44 11.5,42.5 8,42.5 6.27,40.77 J1.2
  Bottom 0.305: v126,43 124,45 95.7,45 v94,43.3 92.4,44.9 77.4,44.9 75,42.5 56.9,42.5 v56,43.4 54.9,44.5 25.5,44.5 v24,43 23,44 v13,44
VCC  (via drill 0.5)
  Top 0.254: IC3.9 97.54,37.54
  Top 0.305: R65.2 v141,24 | 83,42 82.9,41.9 C2.1 62.9,41.9 62,41 62,40 59.54,37.54 IC2.9 | SJ2.2 SJ1.2 60.24,46.76 59.5,47.5 55.6,47.5 51.99,43.89
  Top 0.406: 120.99,43.89 IC4.15 IC4.16 115.62,42.62 115,42 100.1,42 C3.1 100,40 97.54,37.54 | 120.99,43.89 122,42.88 122,42 126.46,37.54 IC4.9 130.04,37.54 131,38.5 131,40 132.35,41.35 137.46,41.35 J2.5 | IC1.9 23.46,37.54 22,39 22,45 | 22,45 22.9,45.9 C1.1 33.6,45.9 35.61,43.89 IC2.15 51.99,43.89 53.92,41.96 53.92,39.08 55.46,37.54 IC2.9 | C4.1 122.6,45.5 120.99,43.89 | IC3.9 94.46,37.54 91.92,40.08 91.92,41.32 90.62,42.62 IC3.16 83.62,42.62 83,42 | J1.5 2.54,31.46 1.5,32.5 1.5,38.5 8.54,45.54 8.54,46 | 22,45 21,46 8.54,46 | 8.54,46 SJ3.2
  Bottom 0.305: v141,24 141,26 144,29 144,35.81 143.27,36.54 J2.5
VIN  (via drill 0.5)
  Top 0.305: R66.2 v144,24
  Top 0.813: C5.+ v73,23 v73,21 v73,19
  pour Bottom: 143,0 arc90 146,3 146,47 arc90 143,50 3,50 arc90 0,47 0,3 arc90 3,0

### Text on the board
tPlace: I2C P/U | 16-Channel I2C RJ45 Breakout | www.superhouse.tv/i2crj45x16 | 0x20 | by Jon Oxer | 0x21 | 0x22 | 0x23 | RST P/U | I2C-BREAKOUT | I2C-BREAKOUT | 1K in series with / each data line | I2CBR | MCP23017 | VCC: 1.8-5.5V / VIN: 12V | MCP23017 | MCP23017 | MCP23017 | I2CBR | VCC | VIN | Super / House | !INT | v3.0
bPlace: RJ45 Pinout | Super / House | www.superhouse.tv | !RST | SCL | SDA | VCC | VIN | GND | GND | VIN | !RST | SDA | VCC | SCL | 24-Channel / I2C RJ45 / Breakout | 1: Data 1 / 2: Data 2 / 3: Data 3 / 4: VIN / 5: VIN / 6: Data 4 / 7: GND / 8: GND | by Jon Oxer | SKU: I2CRJ45X16 | Copyright 2019-2021 SuperHouse Automation Pty Ltd / / Released under the terms of the TAPR / Open Hardware License: www.tapr.org/OHL | www.superhouse.tv/i2crj45x16